# Altium schematic sheet 蜂鸣器.SchDoc
size A4
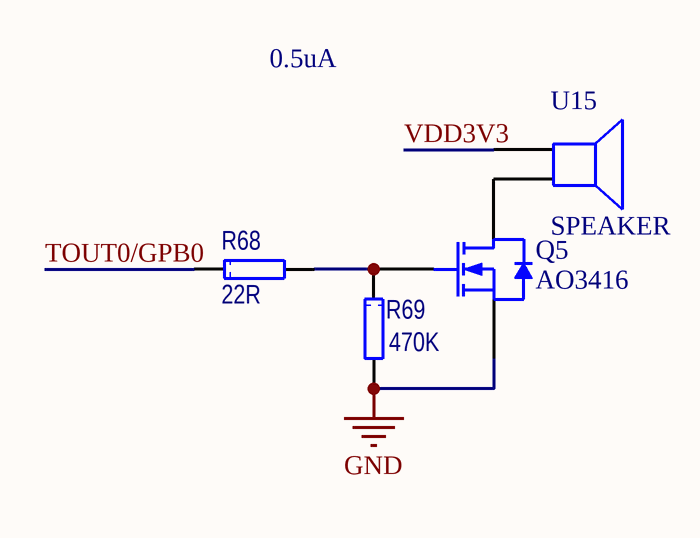
[diagram p0: 蜂鸣器.SchDoc]

## Parts
Q5  AO3416  [SOT23_N]
R68  22R  [1608[0603]R]
R69  470K  [1608[0603]R]
U15  SPEAKER  [Speaker]

## Nets
GND: Q5.2(S) R69.2
TOUT0/GPB0: R68.1
VDD3V3: U15.1
NetQ5_1: Q5.1(G) R68.2 R69.1
NetQ5_3: Q5.3(D) U15.2

## Notes on the sheet
- 0.5uA

## Library data of the parts
Q5 = 2N7002: NMOS; Published: 17-Sep-2003; LatestRevisionDate: 12-Dec-2006; LatestRevisionNote: IPC-7351 Footprint Added.; DatasheetVersion: 27-Jul-2000; PackageVersion: May-1999; PackageReference: SOT23; Publisher: Altium Limited; PackageDescription: 3-Pin SOT-23 Package 0.95 mm Pitch, 2.3 mm Lead Span; ComponentLink1Description: Manufacturer Link; ComponentLink1URL: http://www.semiconductors.philips.com/; ComponentLink2Description: Datasheet; ComponentLink2URL: http://www.semiconductors.philips.com/acrobat/datasheets/2N7002_4.pdf
R68 = RES: Manufacturer: vishay; Model: CRCW060322R0KKEDTR; Parameters: 50V 1/10W 0.5%; Type: 无铅电阻; Value: 22R
R69 = RES: Manufacturer: vishay; Model: CRCW0603470K0KKEDTR; Parameters: 50V 1/10W 0.5%; Type: 无铅电阻; Value: 470K
U15 = SPEAKER: BUZ